# Altium project Mainboard.PrjPCB (part 2 of 2)
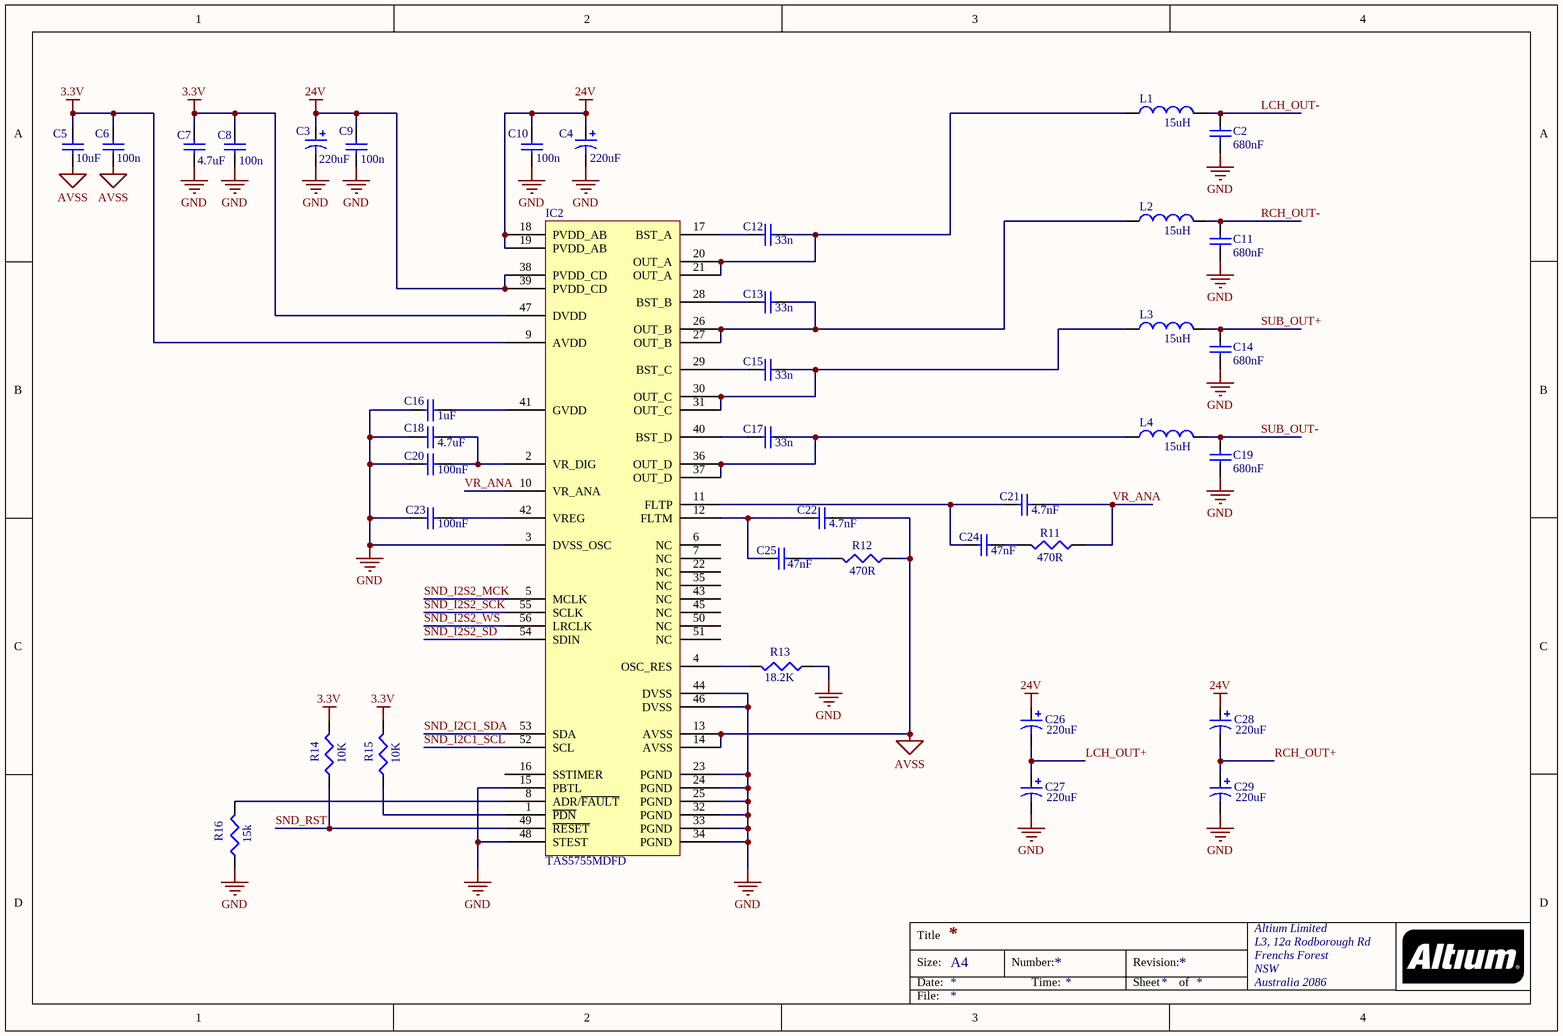
[diagram p8: Digital Audio Amp.SchDoc]

## Nets that join several sheets
3.3V: Microcontroller (25 pins), Connectors (11 pins), Switch Matrix Driver (C54.2 C55.2 U6.24 U7.24), Digital Audio Amp (8 pins)
5V: Solenoid and Flasher Driver (8 pins), Dot Matrix Display Driver (C49.2 U13.24), Connectors (D2.2 POWER.4 R8.2), Stepper Motor Driver (7 pins), Lamp Matrix and GI Driver (C30.2 U1.24 U12.2 U14.2)
12V: Connectors (D3.2 POWER.2 R9.2), Stepper Motor Driver (C57.2 C59.2 U10.10 U11.10)
24V: Connectors (D4.2 POWER.1 R10.2), Digital Audio Amp (10 pins)
GND: Microcontroller (31 pins), Solenoid and Flasher Driver (128 pins), Dot Matrix Display Driver (11 pins), Connectors (35 pins), Stepper Motor Driver (11 pins), Switch Matrix Driver (18 pins), Lamp Matrix and GI Driver (34 pins), Digital Audio Amp (29 pins)
V_LIGHT: Connectors (D5.2 POWER.3 R80.2), Lamp Matrix and GI Driver (20 pins)
DISP_CL: Microcontroller (IC1.42), Dot Matrix Display Driver (U13.5)
DISP_DE: Microcontroller (IC1.46), Dot Matrix Display Driver (U13.2)
DISP_RCLK: Microcontroller (IC1.44), Dot Matrix Display Driver (U13.4)
DISP_RD: Microcontroller (IC1.45), Dot Matrix Display Driver (U13.3)
DISP_SPI1_MOSI: Microcontroller (IC1.43), Dot Matrix Display Driver (U13.7)
DISP_SPI1_SCK: Microcontroller (IC1.41), Dot Matrix Display Driver (U13.6)
GI_MCU: Microcontroller (IC1.34), Lamp Matrix and GI Driver (U14.3)
GI_MCU2: Microcontroller (IC1.36), Lamp Matrix and GI Driver (U12.3)
GI_PWR: Connectors (GI.1 GI.3), Lamp Matrix and GI Driver (Q63.2)
GI_PWR2: Connectors (GI.2 GI.4), Lamp Matrix and GI Driver (Q21.2)
LCH_OUT+: Connectors (SOUND.6), Digital Audio Amp (C26.2 C27.1)
LCH_OUT-: Connectors (SOUND.5), Digital Audio Amp (C2.1 L1.2)
LGT_COL 1: Connectors (LAMP_MATRIX.11), Lamp Matrix and GI Driver (Q11.1)
LGT_COL 2: Connectors (LAMP_MATRIX.12), Lamp Matrix and GI Driver (Q12.1)
LGT_COL 3: Connectors (LAMP_MATRIX.13), Lamp Matrix and GI Driver (Q13.1)
LGT_COL 4: Connectors (LAMP_MATRIX.14), Lamp Matrix and GI Driver (Q14.1)
LGT_COL 5: Connectors (LAMP_MATRIX.15), Lamp Matrix and GI Driver (Q15.1)
LGT_COL 6: Connectors (LAMP_MATRIX.16), Lamp Matrix and GI Driver (Q16.1)
LGT_COL 7: Connectors (LAMP_MATRIX.17), Lamp Matrix and GI Driver (Q17.1)
LGT_COL 8: Connectors (LAMP_MATRIX.18), Lamp Matrix and GI Driver (Q18.1)
LGT_COL 9: Connectors (LAMP_MATRIX.19), Lamp Matrix and GI Driver (Q19.1)
LGT_COL 10: Connectors (LAMP_MATRIX.20), Lamp Matrix and GI Driver (Q20.1)
LGT_MCU 1: Microcontroller (IC1.1), Lamp Matrix and GI Driver (U9.3)
LGT_MCU 2: Microcontroller (IC1.2), Lamp Matrix and GI Driver (U9.2)
LGT_MCU 3: Microcontroller (IC1.3), Lamp Matrix and GI Driver (U9.1)
LGT_MCU 4: Microcontroller (IC1.4), Lamp Matrix and GI Driver (U8.7)
LGT_MCU 5: Microcontroller (IC1.5), Lamp Matrix and GI Driver (U8.6)
LGT_MCU 6: Microcontroller (IC1.7), Lamp Matrix and GI Driver (U8.5)
LGT_MCU 7: Microcontroller (IC1.10), Lamp Matrix and GI Driver (U8.4)
LGT_MCU 8: Microcontroller (IC1.11), Lamp Matrix and GI Driver (U8.3)
LGT_MCU 9: Microcontroller (IC1.12), Lamp Matrix and GI Driver (U8.2)
LGT_MCU 10: Microcontroller (IC1.13), Lamp Matrix and GI Driver (U8.1)
LGT_MCU 11: Microcontroller (IC1.14), Lamp Matrix and GI Driver (U1.11)
LGT_MCU 12: Microcontroller (IC1.15), Lamp Matrix and GI Driver (U1.10)
LGT_MCU 13: Microcontroller (IC1.18), Lamp Matrix and GI Driver (U1.9)
LGT_MCU 14: Microcontroller (IC1.19), Lamp Matrix and GI Driver (U1.8)
LGT_MCU 15: Microcontroller (IC1.20), Lamp Matrix and GI Driver (U1.7)
LGT_MCU 16: Microcontroller (IC1.21), Lamp Matrix and GI Driver (U1.6)
LGT_MCU 17: Microcontroller (IC1.22), Lamp Matrix and GI Driver (U1.5)
LGT_MCU 18: Microcontroller (IC1.26), Lamp Matrix and GI Driver (U1.4)
LGT_MCU 19: Microcontroller (IC1.27), Lamp Matrix and GI Driver (U1.3)
LGT_MCU 20: Microcontroller (IC1.28), Lamp Matrix and GI Driver (U1.2)
LGT_ROW 1: Connectors (LAMP_MATRIX.1), Lamp Matrix and GI Driver (Q1.1)
LGT_ROW 2: Connectors (LAMP_MATRIX.2), Lamp Matrix and GI Driver (Q2.1)
LGT_ROW 3: Connectors (LAMP_MATRIX.3), Lamp Matrix and GI Driver (Q3.1)
LGT_ROW 4: Connectors (LAMP_MATRIX.4), Lamp Matrix and GI Driver (Q4.1)
LGT_ROW 5: Connectors (LAMP_MATRIX.5), Lamp Matrix and GI Driver (Q5.1)
LGT_ROW 6: Connectors (LAMP_MATRIX.6), Lamp Matrix and GI Driver (Q6.1)
LGT_ROW 7: Connectors (LAMP_MATRIX.7), Lamp Matrix and GI Driver (Q7.1)
LGT_ROW 8: Connectors (LAMP_MATRIX.8), Lamp Matrix and GI Driver (Q8.1)
LGT_ROW 9: Connectors (LAMP_MATRIX.9), Lamp Matrix and GI Driver (Q9.1)
LGT_ROW 10: Connectors (LAMP_MATRIX.10), Lamp Matrix and GI Driver (Q10.1)
RCH_OUT+: Connectors (SOUND.3), Digital Audio Amp (C28.2 C29.1)
RCH_OUT-: Connectors (SOUND.4), Digital Audio Amp (C11.1 L2.2)
SD_SDIO_CLK: Microcontroller (IC1.113), Connectors (SD.5)
SD_SDIO_CMD: Microcontroller (IC1.116), Connectors (R4.1 SD.2)
SD_SDIO_D0: Microcontroller (IC1.98), Connectors (R3.1 SD.7)
SD_SDIO_D1: Microcontroller (IC1.99), Connectors (R2.1 SD.8)
SD_SDIO_D2: Microcontroller (IC1.111), Connectors (R1.1 SD.9)
SD_SDIO_D3: Microcontroller (IC1.112), Connectors (R5.1 SD.1)
SND_I2C1_SCL: Microcontroller (IC1.136 R52.1), Connectors (I2C.1), Stepper Motor Driver (IC3.14 IC4.14), Digital Audio Amp (IC2.52)
SND_I2C1_SDA: Microcontroller (IC1.140 R51.1), Connectors (I2C.2), Stepper Motor Driver (IC3.15 IC4.15), Digital Audio Amp (IC2.53)
SND_I2S2_MCK: Microcontroller (IC1.96), Digital Audio Amp (IC2.5)
SND_I2S2_SCK: Microcontroller (IC1.74), Digital Audio Amp (IC2.55)
SND_I2S2_SD: Microcontroller (IC1.29), Digital Audio Amp (IC2.54)
SND_I2S2_WS: Microcontroller (IC1.73), Digital Audio Amp (IC2.56)
SOL_EN: Microcontroller (IC1.35 R50.2 R121.2), Solenoid and Flasher Driver (8 pins)
SOL_MCU 1: Microcontroller (IC1.75), Solenoid and Flasher Driver (U2.11)
SOL_MCU 2: Microcontroller (IC1.76), Solenoid and Flasher Driver (U2.10)
SOL_MCU 3: Microcontroller (IC1.77), Solenoid and Flasher Driver (U2.9)
SOL_MCU 4: Microcontroller (IC1.78), Solenoid and Flasher Driver (U2.8)
SOL_MCU 5: Microcontroller (IC1.79), Solenoid and Flasher Driver (U2.7)
SOL_MCU 6: Microcontroller (IC1.80), Solenoid and Flasher Driver (U2.6)
SOL_MCU 7: Microcontroller (IC1.81), Solenoid and Flasher Driver (U2.5)
SOL_MCU 8: Microcontroller (IC1.82), Solenoid and Flasher Driver (U2.4)
SOL_MCU 9: Microcontroller (IC1.85), Solenoid and Flasher Driver (U2.3)
SOL_MCU 10: Microcontroller (IC1.86), Solenoid and Flasher Driver (U2.2)
SOL_MCU 11: Microcontroller (IC1.87), Solenoid and Flasher Driver (U3.11)
SOL_MCU 12: Microcontroller (IC1.88), Solenoid and Flasher Driver (U3.10)
SOL_MCU 13: Microcontroller (IC1.89), Solenoid and Flasher Driver (U3.9)
SOL_MCU 14: Microcontroller (IC1.90), Solenoid and Flasher Driver (U3.8)
SOL_MCU 15: Microcontroller (IC1.91), Solenoid and Flasher Driver (U3.7)
SOL_MCU 16: Microcontroller (IC1.92), Solenoid and Flasher Driver (U3.6)
SOL_MCU 17: Microcontroller (IC1.93), Solenoid and Flasher Driver (U3.5)
SOL_MCU 18: Microcontroller (IC1.97), Solenoid and Flasher Driver (U3.4)
SOL_MCU 19: Microcontroller (IC1.100), Solenoid and Flasher Driver (U3.3)
SOL_MCU 20: Microcontroller (IC1.110), Solenoid and Flasher Driver (U3.2)
SOL_MCU 21: Microcontroller (IC1.47), Solenoid and Flasher Driver (U4.11)
SOL_MCU 22: Microcontroller (IC1.48), Solenoid and Flasher Driver (U4.10)
SOL_MCU 23: Microcontroller (IC1.49), Solenoid and Flasher Driver (U4.9)
SOL_MCU 24: Microcontroller (IC1.50), Solenoid and Flasher Driver (U4.8)
SOL_MCU 25: Microcontroller (IC1.53), Solenoid and Flasher Driver (U4.7)
SOL_MCU 26: Microcontroller (IC1.54), Solenoid and Flasher Driver (U4.6)
SOL_MCU 27: Microcontroller (IC1.55), Solenoid and Flasher Driver (U4.5)
SOL_MCU 28: Microcontroller (IC1.56), Solenoid and Flasher Driver (U4.4)
SOL_MCU 29: Microcontroller (IC1.57), Solenoid and Flasher Driver (U4.3)
SOL_MCU 30: Microcontroller (IC1.58), Solenoid and Flasher Driver (U4.2)
SOL_MCU 31: Microcontroller (IC1.59), Solenoid and Flasher Driver (U5.11)
SOL_MCU 32: Microcontroller (IC1.60), Solenoid and Flasher Driver (U5.10)
SOL_MCU 33: Microcontroller (IC1.63), Solenoid and Flasher Driver (U5.9)
SOL_MCU 34: Microcontroller (IC1.64), Solenoid and Flasher Driver (U5.8)
SOL_MCU 35: Microcontroller (IC1.65), Solenoid and Flasher Driver (U5.7)
SOL_MCU 36: Microcontroller (IC1.66), Solenoid and Flasher Driver (U5.6)
SOL_MCU 37: Microcontroller (IC1.67), Solenoid and Flasher Driver (U5.5)
SOL_MCU 38: Microcontroller (IC1.68), Solenoid and Flasher Driver (U5.4)
SOL_MCU 39: Microcontroller (IC1.69), Solenoid and Flasher Driver (U5.3)
SOL_MCU 40: Microcontroller (IC1.70), Solenoid and Flasher Driver (U5.2)
SOL_PWR 1: Solenoid and Flasher Driver (D6.2 Q22.2), Connectors (SOLENOIDS_DRIVERS_1.1)
SOL_PWR 2: Solenoid and Flasher Driver (D7.2 Q23.2), Connectors (SOLENOIDS_DRIVERS_1.2)
SOL_PWR 3: Solenoid and Flasher Driver (D8.2 Q24.2), Connectors (SOLENOIDS_DRIVERS_1.3)
SOL_PWR 4: Solenoid and Flasher Driver (D9.2 Q25.2), Connectors (SOLENOIDS_DRIVERS_1.4)
SOL_PWR 5: Solenoid and Flasher Driver (D10.2 Q26.2), Connectors (SOLENOIDS_DRIVERS_1.5)
SOL_PWR 6: Solenoid and Flasher Driver (D11.2 Q27.2), Connectors (SOLENOIDS_DRIVERS_1.6)
SOL_PWR 7: Solenoid and Flasher Driver (D12.2 Q28.2), Connectors (SOLENOIDS_DRIVERS_1.7)
SOL_PWR 8: Solenoid and Flasher Driver (D13.2 Q29.2), Connectors (SOLENOIDS_DRIVERS_1.8)
SOL_PWR 9: Solenoid and Flasher Driver (D14.2 Q30.2), Connectors (SOLENOIDS_DRIVERS_1.9)
SOL_PWR 10: Solenoid and Flasher Driver (D15.2 Q31.2), Connectors (SOLENOIDS_DRIVERS_1.10)
SOL_PWR 11: Solenoid and Flasher Driver (D16.2 Q32.2), Connectors (SOLENOIDS_DRIVERS_1.11)
SOL_PWR 12: Solenoid and Flasher Driver (D17.2 Q33.2), Connectors (SOLENOIDS_DRIVERS_1.12)
SOL_PWR 13: Solenoid and Flasher Driver (D18.2 Q34.2), Connectors (SOLENOIDS_DRIVERS_1.13)
SOL_PWR 14: Solenoid and Flasher Driver (D19.2 Q35.2), Connectors (SOLENOIDS_DRIVERS_1.14)
SOL_PWR 15: Solenoid and Flasher Driver (D20.2 Q36.2), Connectors (SOLENOIDS_DRIVERS_1.15)
SOL_PWR 16: Solenoid and Flasher Driver (D21.2 Q37.2), Connectors (SOLENOIDS_DRIVERS_1.16)
SOL_PWR 17: Solenoid and Flasher Driver (D22.2 Q38.2), Connectors (SOLENOIDS_DRIVERS_1.17)
SOL_PWR 18: Solenoid and Flasher Driver (D23.2 Q39.2), Connectors (SOLENOIDS_DRIVERS_1.18)
SOL_PWR 19: Solenoid and Flasher Driver (D24.2 Q40.2), Connectors (SOLENOIDS_DRIVERS_1.19)
SOL_PWR 20: Solenoid and Flasher Driver (D25.2 Q41.2), Connectors (SOLENOIDS_DRIVERS_1.20)
SOL_PWR 21: Solenoid and Flasher Driver (D26.2 Q42.2), Connectors (SOLENOIDS_DRIVERS_2.1)
SOL_PWR 22: Solenoid and Flasher Driver (D27.2 Q43.2), Connectors (SOLENOIDS_DRIVERS_2.2)
SOL_PWR 23: Solenoid and Flasher Driver (D28.2 Q44.2), Connectors (SOLENOIDS_DRIVERS_2.3)
SOL_PWR 24: Solenoid and Flasher Driver (D29.2 Q45.2), Connectors (SOLENOIDS_DRIVERS_2.4)
SOL_PWR 25: Solenoid and Flasher Driver (D30.2 Q46.2), Connectors (SOLENOIDS_DRIVERS_2.5)
SOL_PWR 26: Solenoid and Flasher Driver (D31.2 Q47.2), Connectors (SOLENOIDS_DRIVERS_2.6)
SOL_PWR 27: Solenoid and Flasher Driver (D32.2 Q48.2), Connectors (SOLENOIDS_DRIVERS_2.7)
SOL_PWR 28: Solenoid and Flasher Driver (D33.2 Q49.2), Connectors (SOLENOIDS_DRIVERS_2.8)
SOL_PWR 29: Solenoid and Flasher Driver (D34.2 Q50.2), Connectors (SOLENOIDS_DRIVERS_2.9)
SOL_PWR 30: Solenoid and Flasher Driver (D35.2 Q51.2), Connectors (SOLENOIDS_DRIVERS_2.10)
SOL_PWR 31: Solenoid and Flasher Driver (D36.2 Q52.2), Connectors (SOLENOIDS_DRIVERS_2.11)
SOL_PWR 32: Solenoid and Flasher Driver (D37.2 Q53.2), Connectors (SOLENOIDS_DRIVERS_2.12)
SOL_PWR 33: Solenoid and Flasher Driver (D38.2 Q54.2), Connectors (SOLENOIDS_DRIVERS_2.13)
SOL_PWR 34: Solenoid and Flasher Driver (D39.2 Q55.2), Connectors (SOLENOIDS_DRIVERS_2.14)
SOL_PWR 35: Solenoid and Flasher Driver (D40.2 Q56.2), Connectors (SOLENOIDS_DRIVERS_2.15)
SOL_PWR 36: Solenoid and Flasher Driver (D41.2 Q57.2), Connectors (SOLENOIDS_DRIVERS_2.16)
SOL_PWR 37: Solenoid and Flasher Driver (D42.2 Q58.2), Connectors (SOLENOIDS_DRIVERS_2.17)
SOL_PWR 38: Solenoid and Flasher Driver (D43.2 Q59.2), Connectors (SOLENOIDS_DRIVERS_2.18)
SOL_PWR 39: Solenoid and Flasher Driver (D44.2 Q60.2), Connectors (SOLENOIDS_DRIVERS_2.19)
SOL_PWR 40: Solenoid and Flasher Driver (D45.2 Q61.2), Connectors (SOLENOIDS_DRIVERS_2.20)
STEP1_OUT0: Connectors (STEPPER_DRIVERS.19), Stepper Motor Driver (U10.17 U10.18)
STEP1_OUT1: Connectors (STEPPER_DRIVERS.18), Stepper Motor Driver (U10.15 U10.16)
STEP1_OUT2: Connectors (STEPPER_DRIVERS.17), Stepper Motor Driver (U10.13 U10.14)
STEP1_OUT3: Connectors (STEPPER_DRIVERS.16), Stepper Motor Driver (U10.11 U10.12)
STEP1_P0: Connectors (STEPPER_DRIVERS.9), Stepper Motor Driver (IC3.1)
STEP1_P1: Connectors (STEPPER_DRIVERS.8), Stepper Motor Driver (IC3.2)
STEP1_P2: Connectors (STEPPER_DRIVERS.7), Stepper Motor Driver (IC3.3)
STEP1_P3: Connectors (STEPPER_DRIVERS.6), Stepper Motor Driver (IC3.4)
STEP2_OUT0: Connectors (STEPPER_DRIVERS.15), Stepper Motor Driver (U11.17 U11.18)
STEP2_OUT1: Connectors (STEPPER_DRIVERS.14), Stepper Motor Driver (U11.15 U11.16)
STEP2_OUT2: Connectors (STEPPER_DRIVERS.13), Stepper Motor Driver (U11.13 U11.14)
STEP2_OUT3: Connectors (STEPPER_DRIVERS.12), Stepper Motor Driver (U11.11 U11.12)
STEP2_P0: Connectors (STEPPER_DRIVERS.5), Stepper Motor Driver (IC4.1)
STEP2_P1: Connectors (STEPPER_DRIVERS.4), Stepper Motor Driver (IC4.2)
STEP2_P2: Connectors (STEPPER_DRIVERS.3), Stepper Motor Driver (IC4.3)
STEP2_P3: Connectors (STEPPER_DRIVERS.2), Stepper Motor Driver (IC4.4)
STEP_INT_1: Microcontroller (IC1.37), Stepper Motor Driver (IC3.13)
STEP_INT_2: Microcontroller (IC1.40), Stepper Motor Driver (IC4.13)
SUB_OUT+: Connectors (SOUND.2), Digital Audio Amp (C14.1 L3.2)
SUB_OUT-: Connectors (SOUND.1), Digital Audio Amp (C19.1 L4.2)
SW_COL 1: Connectors (SWITCH_MATRIX.11), Switch Matrix Driver (U6.14)
SW_COL 2: Connectors (SWITCH_MATRIX.12), Switch Matrix Driver (U6.15)
SW_COL 3: Connectors (SWITCH_MATRIX.13), Switch Matrix Driver (U6.16)
SW_COL 4: Connectors (SWITCH_MATRIX.14), Switch Matrix Driver (U6.17)
SW_COL 5: Connectors (SWITCH_MATRIX.15), Switch Matrix Driver (U6.18)
SW_COL 6: Connectors (SWITCH_MATRIX.16), Switch Matrix Driver (U6.19)
SW_COL 7: Connectors (SWITCH_MATRIX.17), Switch Matrix Driver (U6.20)
SW_COL 8: Connectors (SWITCH_MATRIX.18), Switch Matrix Driver (U6.21)
SW_COL 9: Connectors (SWITCH_MATRIX.19), Switch Matrix Driver (U6.22)
SW_COL 10: Connectors (SWITCH_MATRIX.20), Switch Matrix Driver (U6.23)
SW_MCU 1: Microcontroller (IC1.114), Switch Matrix Driver (U6.11)
SW_MCU 2: Microcontroller (IC1.115), Switch Matrix Driver (U6.10)
SW_MCU 3: Microcontroller (IC1.117), Switch Matrix Driver (U6.9)
SW_MCU 4: Microcontroller (IC1.118), Switch Matrix Driver (U6.8)
SW_MCU 5: Microcontroller (IC1.119), Switch Matrix Driver (U6.7)
SW_MCU 6: Microcontroller (IC1.122), Switch Matrix Driver (U6.6)
SW_MCU 7: Microcontroller (IC1.123), Switch Matrix Driver (U6.5)
SW_MCU 8: Microcontroller (IC1.124), Switch Matrix Driver (U6.4)
SW_MCU 9: Microcontroller (IC1.125), Switch Matrix Driver (U6.3)
SW_MCU 10: Microcontroller (IC1.126), Switch Matrix Driver (U6.2)
SW_MCU 11: Microcontroller (IC1.127), Switch Matrix Driver (U7.23)
SW_MCU 12: Microcontroller (IC1.128), Switch Matrix Driver (U7.22)
SW_MCU 13: Microcontroller (IC1.129), Switch Matrix Driver (U7.21)
SW_MCU 14: Microcontroller (IC1.132), Switch Matrix Driver (U7.20)
SW_MCU 15: Microcontroller (IC1.134), Switch Matrix Driver (U7.19)
SW_MCU 16: Microcontroller (IC1.135), Switch Matrix Driver (U7.18)
SW_MCU 17: Microcontroller (IC1.137), Switch Matrix Driver (U7.17)
SW_MCU 18: Microcontroller (IC1.139), Switch Matrix Driver (U7.16)
SW_MCU 19: Microcontroller (IC1.141), Switch Matrix Driver (U7.15)
SW_MCU 20: Microcontroller (IC1.142), Switch Matrix Driver (U7.14)
SW_ROW 1: Connectors (SWITCH_MATRIX.1), Switch Matrix Driver (R57.2 U7.2)
SW_ROW 2: Connectors (SWITCH_MATRIX.2), Switch Matrix Driver (R58.2 U7.3)
SW_ROW 3: Connectors (SWITCH_MATRIX.3), Switch Matrix Driver (R59.2 U7.4)
SW_ROW 4: Connectors (SWITCH_MATRIX.4), Switch Matrix Driver (R60.2 U7.5)
SW_ROW 5: Connectors (SWITCH_MATRIX.5), Switch Matrix Driver (R61.2 U7.6)
SW_ROW 6: Connectors (SWITCH_MATRIX.6), Switch Matrix Driver (R62.2 U7.7)
SW_ROW 7: Connectors (SWITCH_MATRIX.7), Switch Matrix Driver (R63.2 U7.8)
SW_ROW 8: Connectors (SWITCH_MATRIX.8), Switch Matrix Driver (R64.2 U7.9)
SW_ROW 9: Connectors (SWITCH_MATRIX.9), Switch Matrix Driver (R65.2 U7.10)
SW_ROW 10: Connectors (SWITCH_MATRIX.10), Switch Matrix Driver (R66.2 U7.11)
SWD_NRST: Microcontroller (IC1.25), Connectors (DEBUG_/_PROGRAMMING.15)
SWD_SWDCLK: Microcontroller (IC1.109), Connectors (DEBUG_/_PROGRAMMING.9)
SWD_SWDIO: Microcontroller (IC1.105), Connectors (DEBUG_/_PROGRAMMING.7)
SWD_SWO: Microcontroller (IC1.133), Connectors (DEBUG_/_PROGRAMMING.13)
USB_OTG_DM: Microcontroller (IC1.103), Connectors (USB.2)
USB_OTG_DP: Microcontroller (IC1.104), Connectors (USB.3)
USB_OTG_ID: Microcontroller (IC1.102), Connectors (USB.4)
USB_OTG_VBUS: Microcontroller (IC1.101), Connectors (USB.1)
VBAT: Microcontroller (IC1.6), Connectors (BATTERY.+)